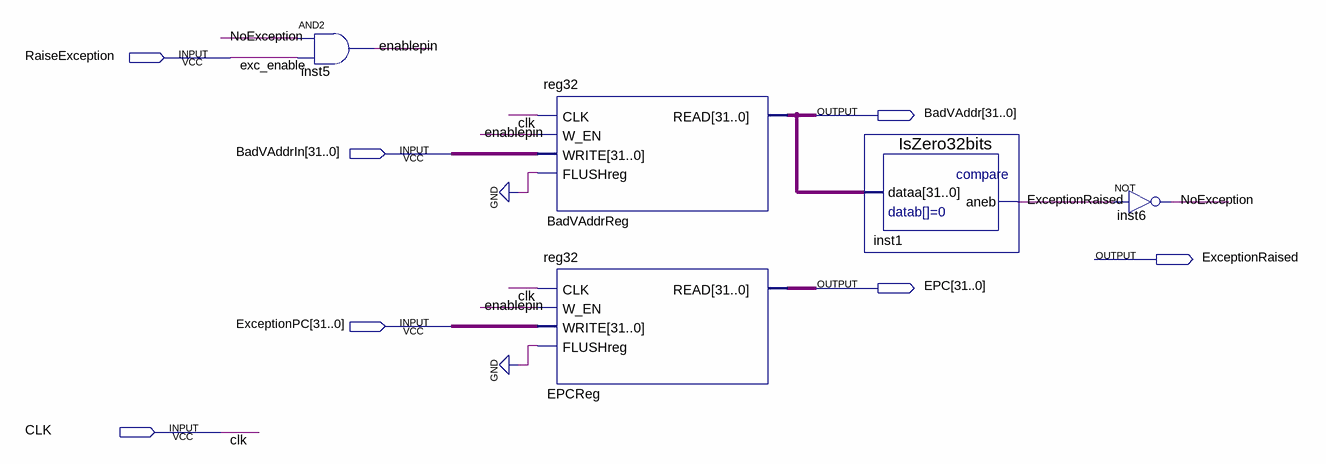
[diagram p0: schematic sheet]
// Quartus schematic MemoryExceptionHandler.bdf as structural Verilog: 5 symbols, 7 pins
module MemoryExceptionHandler (
  input  RaiseException,
  input  [31:0] BadVAddrIn,
  input  [31:0] ExceptionPC,
  input  CLK,
  output [31:0] BadVAddr,
  output ExceptionRaised,
  output [31:0] EPC
);

  wire enablepin, NoException;

  and inst5 (enablepin, NoException, RaiseException);
  reg32 BadVAddrReg (.CLK(CLK), .W_EN(enablepin), .WRITE(BadVAddrIn), .FLUSHreg(1'b0), .READ(BadVAddr));
  reg32 EPCReg (.CLK(CLK), .W_EN(enablepin), .WRITE(ExceptionPC), .FLUSHreg(1'b0), .READ(EPC));
  IsZero32bits inst1 (.dataa(BadVAddr), .aneb(ExceptionRaised));
  not inst6 (NoException, ExceptionRaised);

  // Other names for the same wires on the sheet: exc_enable = RaiseException
endmodule
